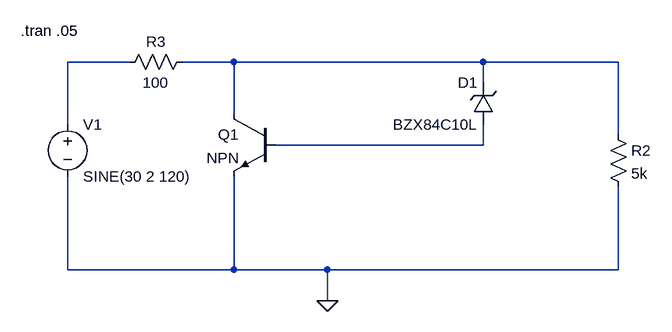
[diagram p0: schematic REGULADORES - Fonte Regulada 3.asc]
REGULADORES - Fonte Regulada 3.asc, the LTspice schematic file:
Version 4
SHEET 1 880 680
WIRE -48 48 -144 48
WIRE 112 48 32 48
WIRE 496 48 112 48
WIRE 704 48 496 48
WIRE 496 80 496 48
WIRE 112 128 112 48
WIRE -144 144 -144 48
WIRE 704 160 704 48
WIRE 496 176 496 144
WIRE 496 176 176 176
WIRE -144 368 -144 224
WIRE 112 368 112 224
WIRE 112 368 -144 368
WIRE 256 368 112 368
WIRE 704 368 704 240
WIRE 704 368 256 368
WIRE 256 416 256 368
FLAG 256 416 0
SYMBOL npn 176 128 M0
SYMATTR InstName Q1
SYMBOL res 688 144 R0
SYMATTR InstName R2
SYMATTR Value 5k
SYMBOL res 48 32 R90
WINDOW 0 0 56 VBottom 2
WINDOW 3 32 56 VTop 2
SYMATTR InstName R3
SYMATTR Value 100
SYMBOL zener 512 144 R180
WINDOW 0 24 64 Left 2
WINDOW 3 24 0 Left 2
SYMATTR InstName D1
SYMATTR Value BZX84C10L
SYMBOL voltage -144 128 R0
WINDOW 123 0 0 Left 2
WINDOW 39 0 0 Left 2
SYMATTR InstName V1
SYMATTR Value SINE(30 2 120)
TEXT -216 0 Left 2 !.tran .05

The netlist it stands for:
* REGULADORES - Fonte Regulada 3.asc
Q1 N002 N003 0 0 NPN
R2 N002 0 5k
R3 N002 N001 100
D1 N003 N002 BZX84C10L
V1 N001 0 SINE(30 2 120)
.model D D
.lib standard.dio
.model NPN NPN
.model PNP PNP
.lib standard.bjt
.tran .05
.backanno
.end